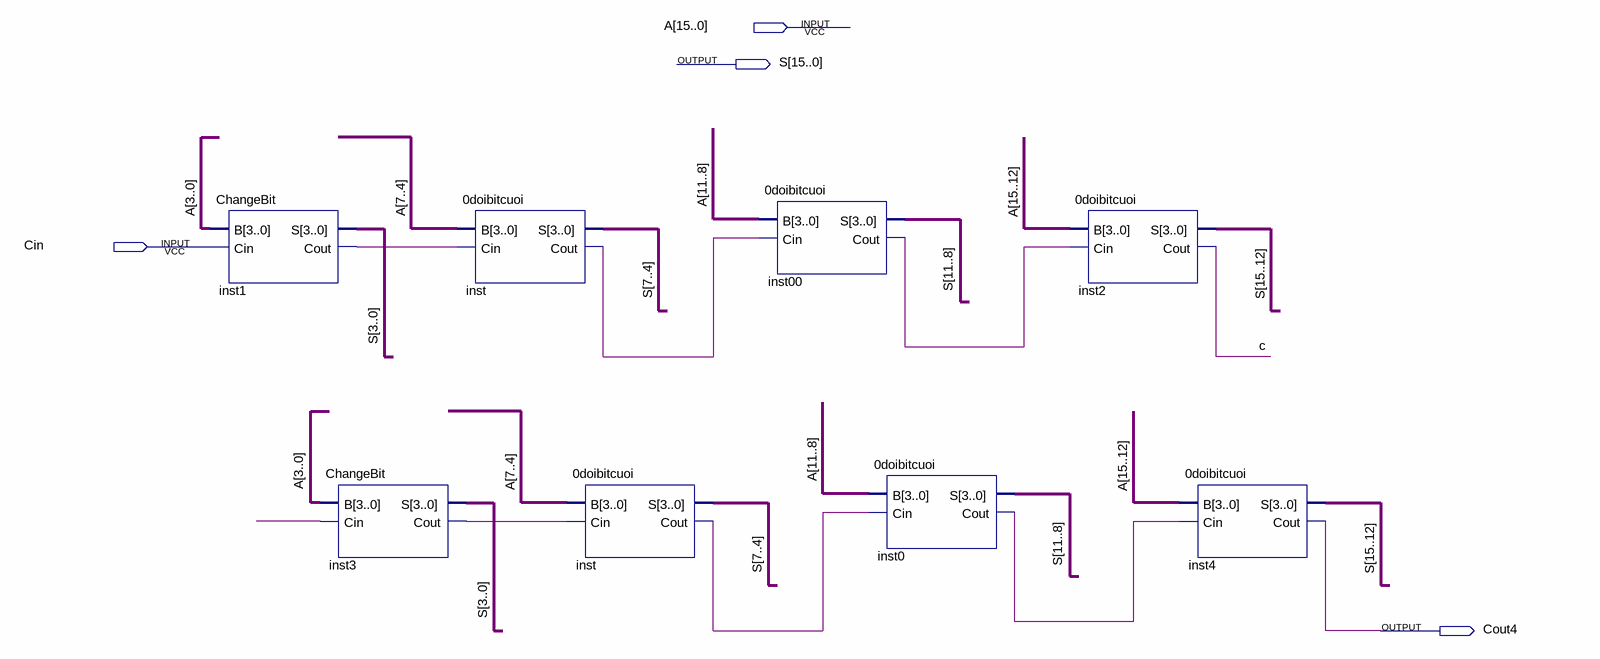
[diagram p0: schematic sheet]
// Quartus schematic test_obit_change.bdf as structural Verilog: 8 symbols, 4 pins
module test_obit_change (
  input  [15:0] A,
  input  Cin,
  output [15:0] S,
  output Cout4
);

  wire c, inst00_cout, inst0_cout, inst1_cout, inst3_cout, inst_cout, inst_cout_2, undriven;

  ChangeBit inst1 (.B(A[3:0]), .Cin(Cin), .S(S[3:0]), .Cout(inst1_cout));
  ChangeBit inst3 (.B(A[3:0]), .Cin(undriven), .S(S[3:0]), .Cout(inst3_cout));
  \0doibitcuoi  inst (.B(A[7:4]), .Cin(inst1_cout), .S(S[7:4]), .Cout(inst_cout));
  \0doibitcuoi  inst_dup2 (.B(A[7:4]), .Cin(inst3_cout), .S(S[7:4]), .Cout(inst_cout_2));
  \0doibitcuoi  inst00 (.B(A[11:8]), .Cin(inst_cout), .S(S[11:8]), .Cout(inst00_cout));
  \0doibitcuoi  inst0 (.B(A[11:8]), .Cin(inst_cout_2), .S(S[11:8]), .Cout(inst0_cout));
  \0doibitcuoi  inst2 (.B(A[15:12]), .Cin(inst00_cout), .S(S[15:12]), .Cout(c));
  \0doibitcuoi  inst4 (.B(A[15:12]), .Cin(inst0_cout), .S(S[15:12]), .Cout(Cout4));
endmodule
